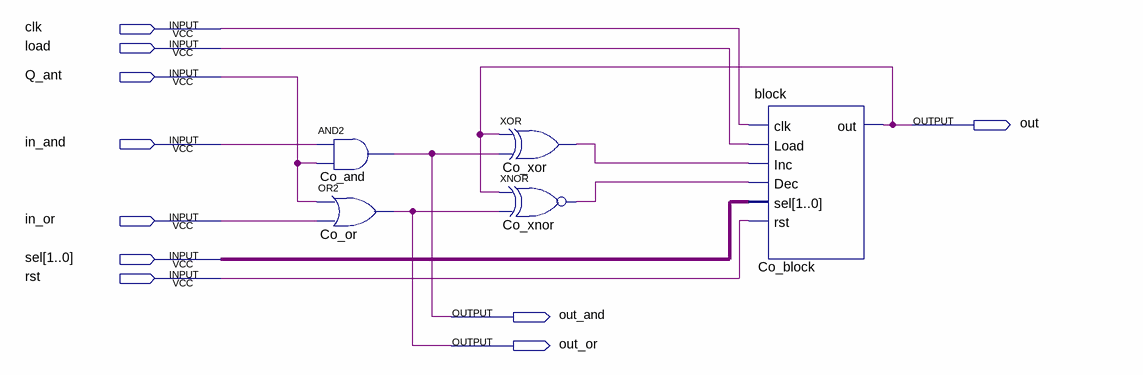
[diagram p0: schematic sheet]
// Quartus schematic bblock.bdf as structural Verilog: 5 symbols, 10 pins
module bblock (
  input  clk,
  input  load,
  input  Q_ant,
  input  in_and,
  input  in_or,
  input  [1:0] sel,
  input  rst,
  output out,
  output out_and,
  output out_or
);

  wire Co_xnor_out, Co_xor_out;

  and Co_and (out_and, in_and, Q_ant);
  or Co_or (out_or, Q_ant, in_or);
  xor Co_xor (Co_xor_out, out, out_and);
  xnor Co_xnor (Co_xnor_out, out, out_or);
  block Co_block (.clk(clk), .Load(load), .Inc(Co_xor_out), .Dec(Co_xnor_out), .sel(sel), .rst(rst), .out(out));
endmodule
